# EAGLE schematic T08-Schematic (EAGLE 7.7.0)
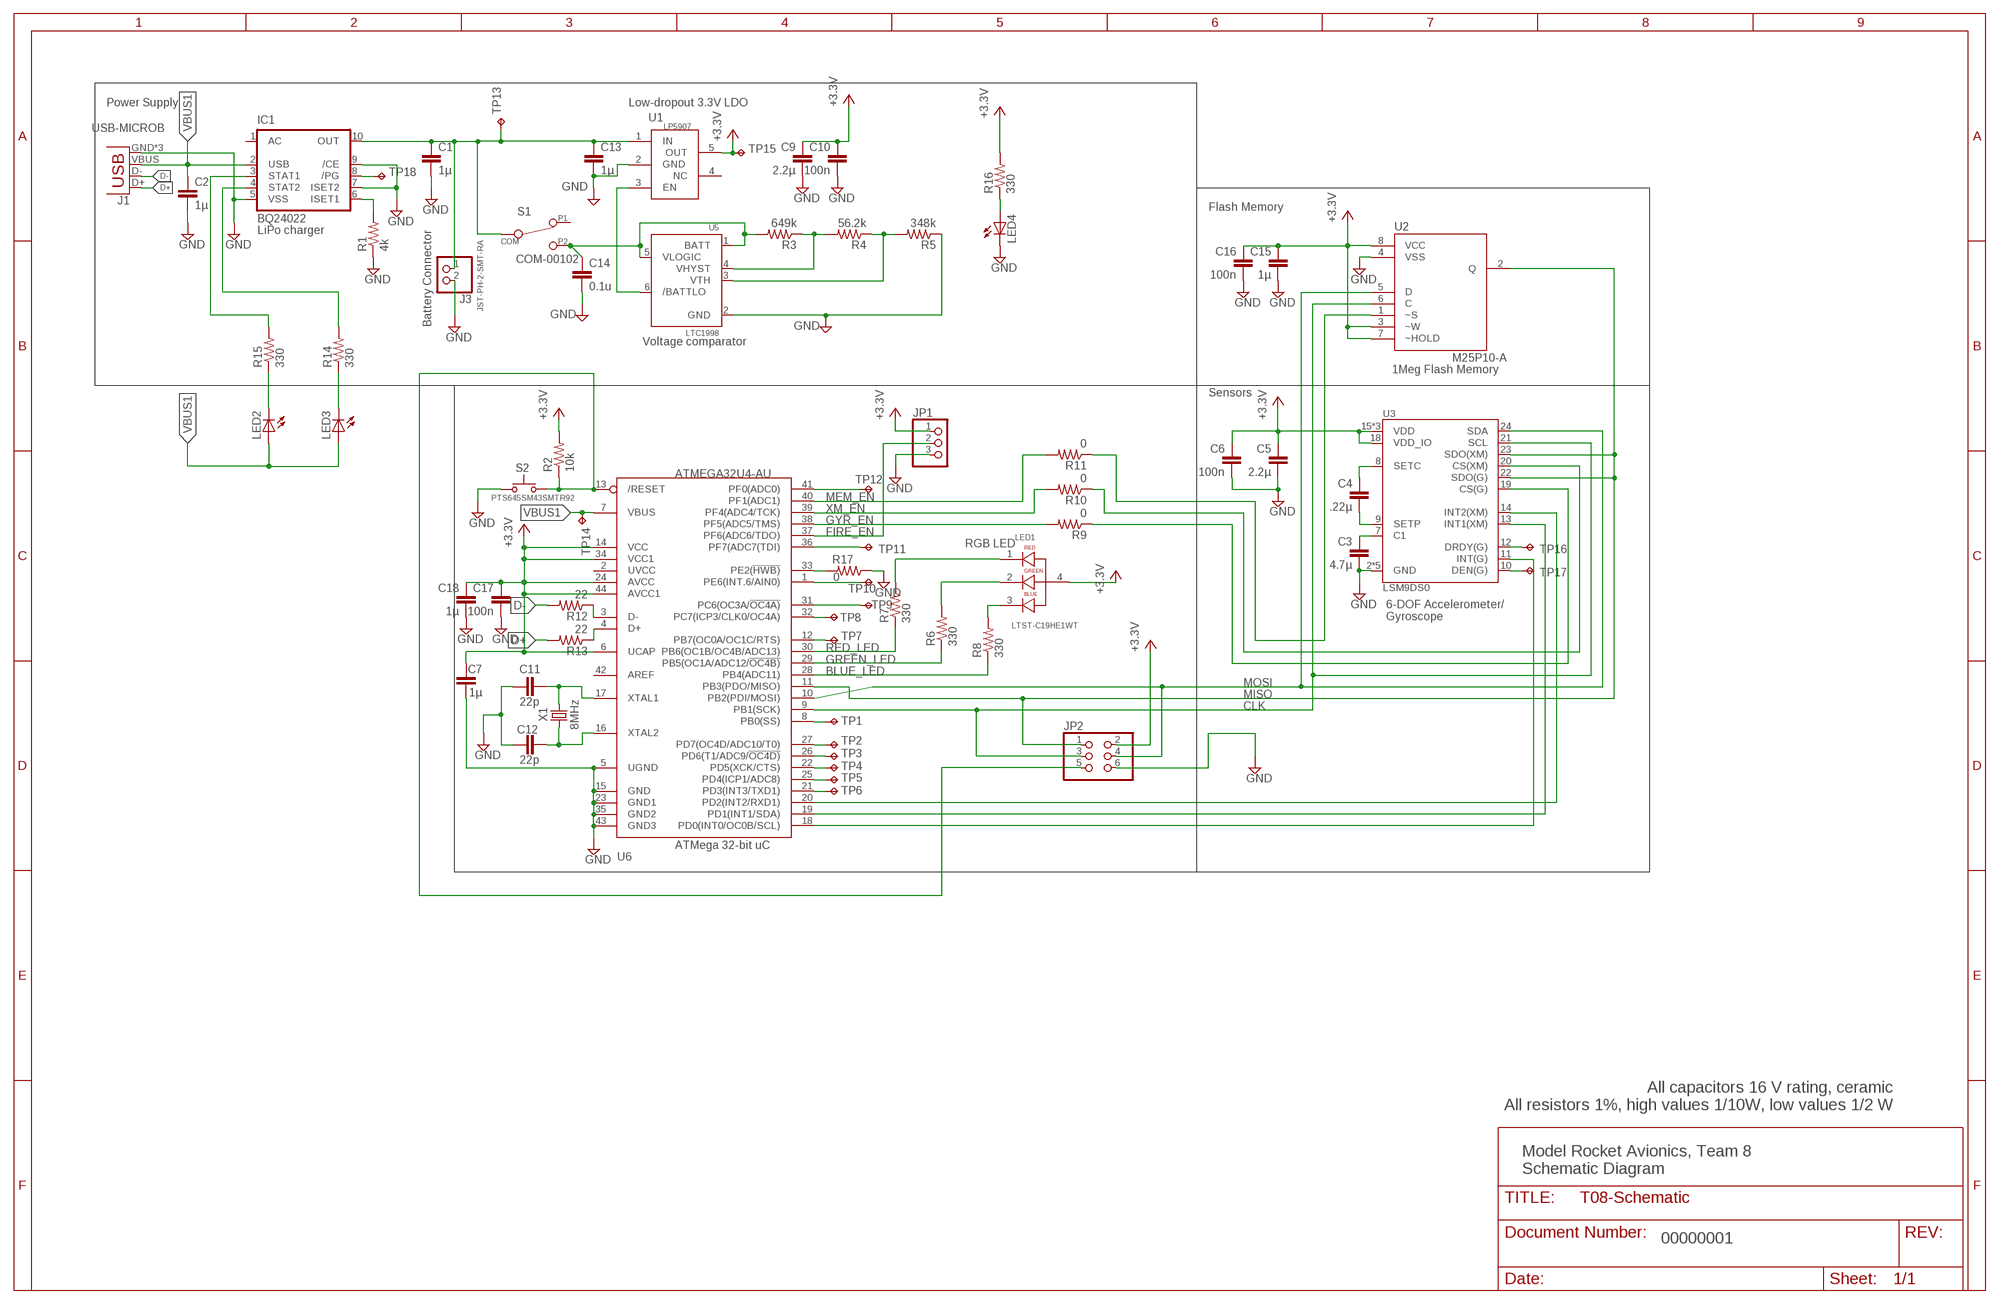
[diagram p0: schematic, sheet 1]

## Parts
C1  1µ  C-EUC0603  [C0603]
C2  1µ  C-EUC0805  [C0805]
C3  4.7µ  C-EUC0603  [C0603]
C4  .22µ  C-EUC0603  [C0603]
C5  2.2µ  C-EUC0603  [C0603]
C6  100n  C-EUC0603  [C0603]
C7  1µ  C-EUC0603  [C0603]
C9  2.2µ  C-EUC0603  [C0603]
C10  100n  C-EUC0603  [C0603]
C11  22p  C-EUC0603  [C0603]
C12  22p  C-EUC0603  [C0603]
C13  1µ  C-EUC0603  [C0603]
C14  0.1u  C-EUC0603  [C0603]
C15  1µ  C-EUC0603  [C0603]
C16  100n  C-EUC0603  [C0603]
C17  100n  C-EUC0603  [C0603]
C18  1µ  C-EUC0603  [C0603]
IC1  BQ24022  [DRC-S-PVSON-N10]
J1  USB-MICROB  [USB-MICROB]
J3  JST-PH-2-SMT-RA  JST_2PIN-SMT-RA  [JST-PH-2-SMT-RA]
JP1  PINHD-1X3  [1X03]
JP2  PINHD-2X3  [2X03]
LED1  LTST-C19HE1WT  [LEDSC85P160X160X35-4N]
LED2  LEDCHIP-LED0603  [CHIP-LED0603]
LED3  LEDCHIP-LED0603  [CHIP-LED0603]
LED4  LEDCHIP-LED0603  [CHIP-LED0603]
R1  4k  R-US_R0603  [R0603]
R2  10k  R-US_R0805  [R0805]
R3  649k  R-US_R0603  [R0603]
R4  56.2k  R-US_R0603  [R0603]
R5  348k  R-US_R0603  [R0603]
R6  330  R-US_R0805  [R0805]
R7  330  R-US_R0805  [R0805]
R8  330  R-US_R0805  [R0805]
R9  0  R-US_R0603  [R0603]
R10  0  R-US_R0603  [R0603]
R11  0  R-US_R0603  [R0603]
R12  22  R-US_R0603  [R0603]
R13  22  R-US_R0603  [R0603]
R14  330  R-US_R0805  [R0805]
R15  330  R-US_R0805  [R0805]
R16  330  R-US_R0805  [R0805]
R17  0  R-US_R0603  [R0603]
S1  COM-00102  [ESWITCH]
S2  PTS645SM43SMTR92  PTS645SSMTR  [PTS645-SMD]
TP1  TPTP08R  [TP08R]
TP2  TPTP08R  [TP08R]
TP3  TPTP08R  [TP08R]
TP4  TPTP08R  [TP08R]
TP5  TPTP08R  [TP08R]
TP6  TPTP08R  [TP08R]
TP7  TPTP08R  [TP08R]
TP8  TPTP08R  [TP08R]
TP9  TPTP08R  [TP08R]
TP10  TPTP08R  [TP08R]
TP11  TPTP08R  [TP08R]
TP12  TPTP08R  [TP08R]
TP13  TPTP08R  [TP08R]
TP14  TPTP08R  [TP08R]
TP15  TPTP08R  [TP08R]
TP16  TPTP08R  [TP08R]
TP17  TPTP08R  [TP08R]
TP18  TPTP08R  [TP08R]
U1  LP5907  [SOT23-5L]
U2  M25P10-AVMN6TP_TR  [SOIC127P600X175-8N]
U3  LSM9DS0  [LGA-24]
U5  LTC1998  [TSOT23-6]
U6  ATMEGA32U4-AU  [TQFP44]
X1  8MHz  CRYSTALS-NOGND-HC49/4H  [HC49]

## Nets
BLUE_LED: R8.1 U6.28(PB4(ADC11))
CLK: JP2.3 U2.6(C) U3.21(SCL) U6.9(PB1(SCK))
D+: J1.D+ R13.2
D-: J1.D- R12.2
FIRE_EN: JP1.2 U6.37(PF6(ADC6/TDO))
GND: C1.2 C2.2 C3.1 C5.2 C6.2 C7.2 C9.2 C10.2 C11.2 C12.2 C13.2 C14.2 C15.2 C16.2 C17.2 C18.2 IC1.5(VSS) IC1.7(ISET2) IC1.9(/CE) J1.GND J1.MT1(GND) J1.MT2(GND) J3.2 JP1.3 JP2.6 LED4.C R1.1 R5.1 R17.1 S2.1(P) S2.2(P) U1.2(GND) U2.4(VSS) U3.2(GND) U3.3(GND) U3.4(GND) U3.5(GND) U3.6(GND) U5.2(GND) U6.5(UGND) U6.15(GND) U6.23(GND1) U6.35(GND2) U6.43(GND3)
GREEN_LED: R6.1 U6.29(PB5(OC1A/ADC12/!OC4B))
GYR_EN: R9.1 U3.19(CS(G))
MEM_EN: R11.1 U2.1(~S)
MISO: JP2.1 U2.2(Q) U3.22(SDO(G)) U3.23(SDO(XM)) U6.11(PB3(PDO/MISO))
MOSI: JP2.4 U2.5(D) U3.24(SDA) U6.10(PB2(PDI/MOSI))
N$1: LED1.1 R7.2
N$2: C11.1 U6.17(XTAL1) X1.1
N$3: JP2.5 R2.1 S2.3(S) S2.4(S) U6.13(/RESET)
N$4: IC1.6(ISET1) R1.2
N$5: C12.1 U6.16(XTAL2) X1.2
N$6: R12.1 U6.3(D-)
N$7: LED1.2 R6.2
N$8: LED1.3 R8.2
N$9: C3.2 U3.7(C1)
N$10: C4.2 U3.8(SETC)
N$11: C4.1 U3.9(SETP)
N$12: R3.1 R4.2 U5.4(VHYST)
N$13: C1.1 C13.1 IC1.10(OUT) J3.1 S1.2(COM) TP13.TP U1.1(IN)
N$14: R4.1 R5.2 U5.3(VTH)
N$15: C14.1 R3.2 S1.3(P2) U5.1(BATT) U5.5(VLOGIC)
N$16: U3.14(INT2(XM)) U6.20(PD2(INT2/RXD1))
N$17: U3.13(INT1(XM)) U6.19(PD1(INT1/SDA))
N$18: U1.3(EN) U5.6(/BATTLO)
N$19: U3.11(INT(G)) U6.18(PD0(INT0/OC0B/SCL))
N$20: R9.2 U6.38(PF5(ADC5/TMS))
N$21: R10.2 U6.39(PF4(ADC4/TCK))
N$22: R11.2 U6.40(PF1(ADC1))
N$47: R13.1 U6.4(D+)
N$48: LED2.C R15.1
N$49: LED3.C R14.1
N$50: IC1.3(STAT1) R15.2
N$51: IC1.4(STAT2) R14.2
N$52: TP3.TP U6.26(PD6(T1/ADC9/!OC4D))
N$53: LED4.A R16.1
N$54: TP12.TP U6.41(PF0(ADC0))
N$55: TP11.TP U6.36(PF7(ADC7(TDI))
N$56: TP10.TP U6.1(PE6(INT.6/AIN0))
N$57: TP9.TP U6.31(PC6(OC3A/!OC4A))
N$58: TP8.TP U6.32(PC7(ICP3/CLK0/OC4A))
N$59: TP7.TP U6.12(PB7(OC0A/OC1C/RTS))
N$60: TP1.TP U6.8(PB0(SS))
N$61: TP2.TP U6.27(PD7(OC4D/ADC10/T0))
N$62: TP4.TP U6.22(PD5(XCK/CTS))
N$63: TP5.TP U6.25(PD4(ICP1/ADC8))
N$64: TP6.TP U6.21(PD3(INT3/TXD1))
N$65: R17.2 U6.33(PE2(!HWB))
N$66: TP17.TP U3.10(DEN(G))
N$67: TP16.TP U3.12(DRDY(G))
N$68: IC1.8(/PG) TP18.TP
RED_LED: R7.1 U6.30(PB6(OC1B/OC4B/ADC13))
VBUS1: C2.1 IC1.2(USB) J1.VBUS LED2.A LED3.A TP14.TP U6.7(VBUS)
VCC: C5.1 C6.1 C7.1 C9.1 C10.1 C15.1 C16.1 C17.1 C18.1 JP1.1 JP2.2 LED1.4 R2.2 R16.2 TP15.TP U1.5(OUT) U2.3(~W) U2.7(~HOLD) U2.8(VCC) U3.15(VDD) U3.16(VDD) U3.17(VDD) U3.18(VDD_IO) U6.6(UCAP) U6.14(VCC) U6.24(AVCC) U6.34(VCC1) U6.44(AVCC1) ; supply symbol labelled +3.3V
XM_EN: R10.1 U3.20(CS(XM))
Unconnected: IC1.1(AC) IC1.TH S1.1 U1.4(NC) U6.2(UVCC) U6.42(AREF)

## Notes on the sheet
- Power Supply | Low-dropout 3.3V LDO
- U1
- Flash Memory
- U2
- LiPo charger
- Battery Connector
- Voltage comparator
- 1Meg Flash Memory
- Sensors
- RGB LED
- 6-DOF Accelerometer/
  Gyroscope
- ATMega 32-bit uC
- All capacitors 16 V rating, ceramic
  All resistors 1%, high values 1/10W, low values 1/2 W
- Model Rocket Avionics, Team 8
  Schematic Diagram
- 00000001

## Library data of the parts
C1-C7 C9-C18 = rcl:C-EU: CAPACITOR, European symbol
IC1 = tinyav-lib:BQ24022: SINGLE-CHIP, LI-ION AND LI-POL CHARGER IC WITH AUTONOMOUS USB-PORT AND AC-ADAPTER SUPPLY MANAGEMENT (bqTINY™-II) Source: bq24022.pdf (www.ti.com)
J1 = SparkFun-Connectors:USB: USB Connectors USB-B-PTH is fully proven SKU : PRT-00139/CONN-08278 USB-miniB is fully proven SKU : PRT-00587 USB-A-PCB is untested. USB-A-H is throughly reviewed, but untested. Spark Fun Electronics SKU : PRT-00437 USB-B-SMT is throughly reviewed, but untested. Needs silkscreen touching up. USB-A-S has not been used/tested USB-MB-H has not been used/tested USB-MICROB has been used. CONN-09505; PROD_ID: CONN-09505
J3 = adafruit:JST_2PIN: JST 2-Pin Connectors of various flavors SMT-RA (S2B-PH-SM4) 4UConnector #17311 SMT (B2B-PH-SM4) THM-RA (S2B-PH) THM (B2B-PH)
JP1 = pinhead:PINHD-1X3: PIN HEADER
JP2 = pinhead:PINHD-2X3: PIN HEADER
LED1 = LTST-C19HE1WT:LTST-C19HE1WT: R/G/B 0606 Flat Top Rectangle 130° 112.5/281/104 mcd Diffused Chip LED; AVAILABILITY: Good; DESCRIPTION: R/G/B 0606 Flat Top Rectangle 130° 112.5/281/104 mcd Diffused Chip LED; MF: Lite-On; MP: LTST-C19HE1WT; PACKAGE: None; PRICE: 0.59 USD; VENDOR: DIGIKEY; VENDOR_PN: 160-2162-1-ND
LED2-LED4 = adafruit:LED: LED OSRAM: - CHIPLED LG R971, LG N971, LY N971, LG Q971, LY Q971, LO R971, LY R971 LH N974, LH R974 LS Q976, LO Q976, LY Q976 LO Q996 - Hyper CHIPLED LW Q18S LB Q993, LB Q99A, LB R99A - SideLED LS A670, LO A670, LY A670, LG A670, LP A670 LB A673, LV A673, LT A673, LW A673 LH A674 LY A675 LS A676, LA A676, LO A676, LY A676, LW A676 LS A679, LY A679, LG A679 - Hyper Micro SIDELED® LS Y876, LA Y876, LO Y876, LY Y876 LT Y87S - SmartLED LW L88C, LW L88S LB L89C, LB L89S, LG L890 LS L89K, LO L89K, LY L89K LS L896, LA L896, LO L896, LY L896 - TOPLED LS T670, LO T670, LY T670, LG T670, LP T670 LSG T670, LSP T670, LSY T670, LOP T670, LYG T670 LG T671, LOG T671, LSG T671 LB T673, LV T673, LT T673, LW T673 LH T674 LS T676, LA T676, LO T676, LY T676, LB T676, LH T676, LSB T676, LW T676 LB T67C, LV T67C, LT T67C, LS T67K, LO T67K, LY T67K, LW E67C LS E67B, LA E67B, LO E67B, LY E67B, LB E67C, LV E67C, LT E67C LW T67C LS T679, LY T679, LG T679 LS T770, LO T770, LY T770, LG T770, LP T770 LB T773, LV T773, LT T773, LW T773 LH T774 LS E675, LA E675, LY E675, LS T675 LS T776, LA T776, LO T776, LY T776, LB T776 LHGB T686 LT T68C, LB T68C - Hyper Mini TOPLED® LB M676 - Mini TOPLED Santana® LG M470 LS M47K, LO M47K, LY M47K Source: http://www.osram.convergy.de/
R1-R17 = rcl:R-US_: RESISTOR, American symbol
S1 = tinyav-lib:COM-00102: Small SPDT switch listed on SparkFun as COM-00102. Equivalent to E-Switch EG1218.
S2 = switch-ck:PTS645S???SMTR: TACT SWITCH; MPN: PTS645SM43SMTR92 LFS; VENDOR: DIGIKEY; VENDOR_PN: CKN9112CT-ND
TP1-TP18 = testpad:TP: Test pad
U1 = adafruit:LP5907
U2 = SOIC127P600X175-8N:M25P10-AVMN6TP_TR
U3 = LSM9DS0:LSM9DS0; AVAILABILITY: Warning; DESCRIPTION: iNEMO inertial module: 3D accelerometer, 3D gyroscope, 3D magnetometer; MF: STMicroelectronics; MP: LSM9DS0; PACKAGE: LGA-24 STMicroelectronics; PRICE: 4.67 USD
U5 = tinyav-lib:LTC1998
U6 = adafruit:ATMEGA32U4: http://www.ladyada.net/library/eagle
X1 = IQD-Frequency-Products:CRYSTALS-NOGND: CRYSTALS CAN NOT GROUNDED; MPN: ATS080B; VENDOR: DIGIKEY; VENDOR_PN: CTX900-ND